# EAGLE schematic Aux Board V1 (EAGLE 9.2.0)
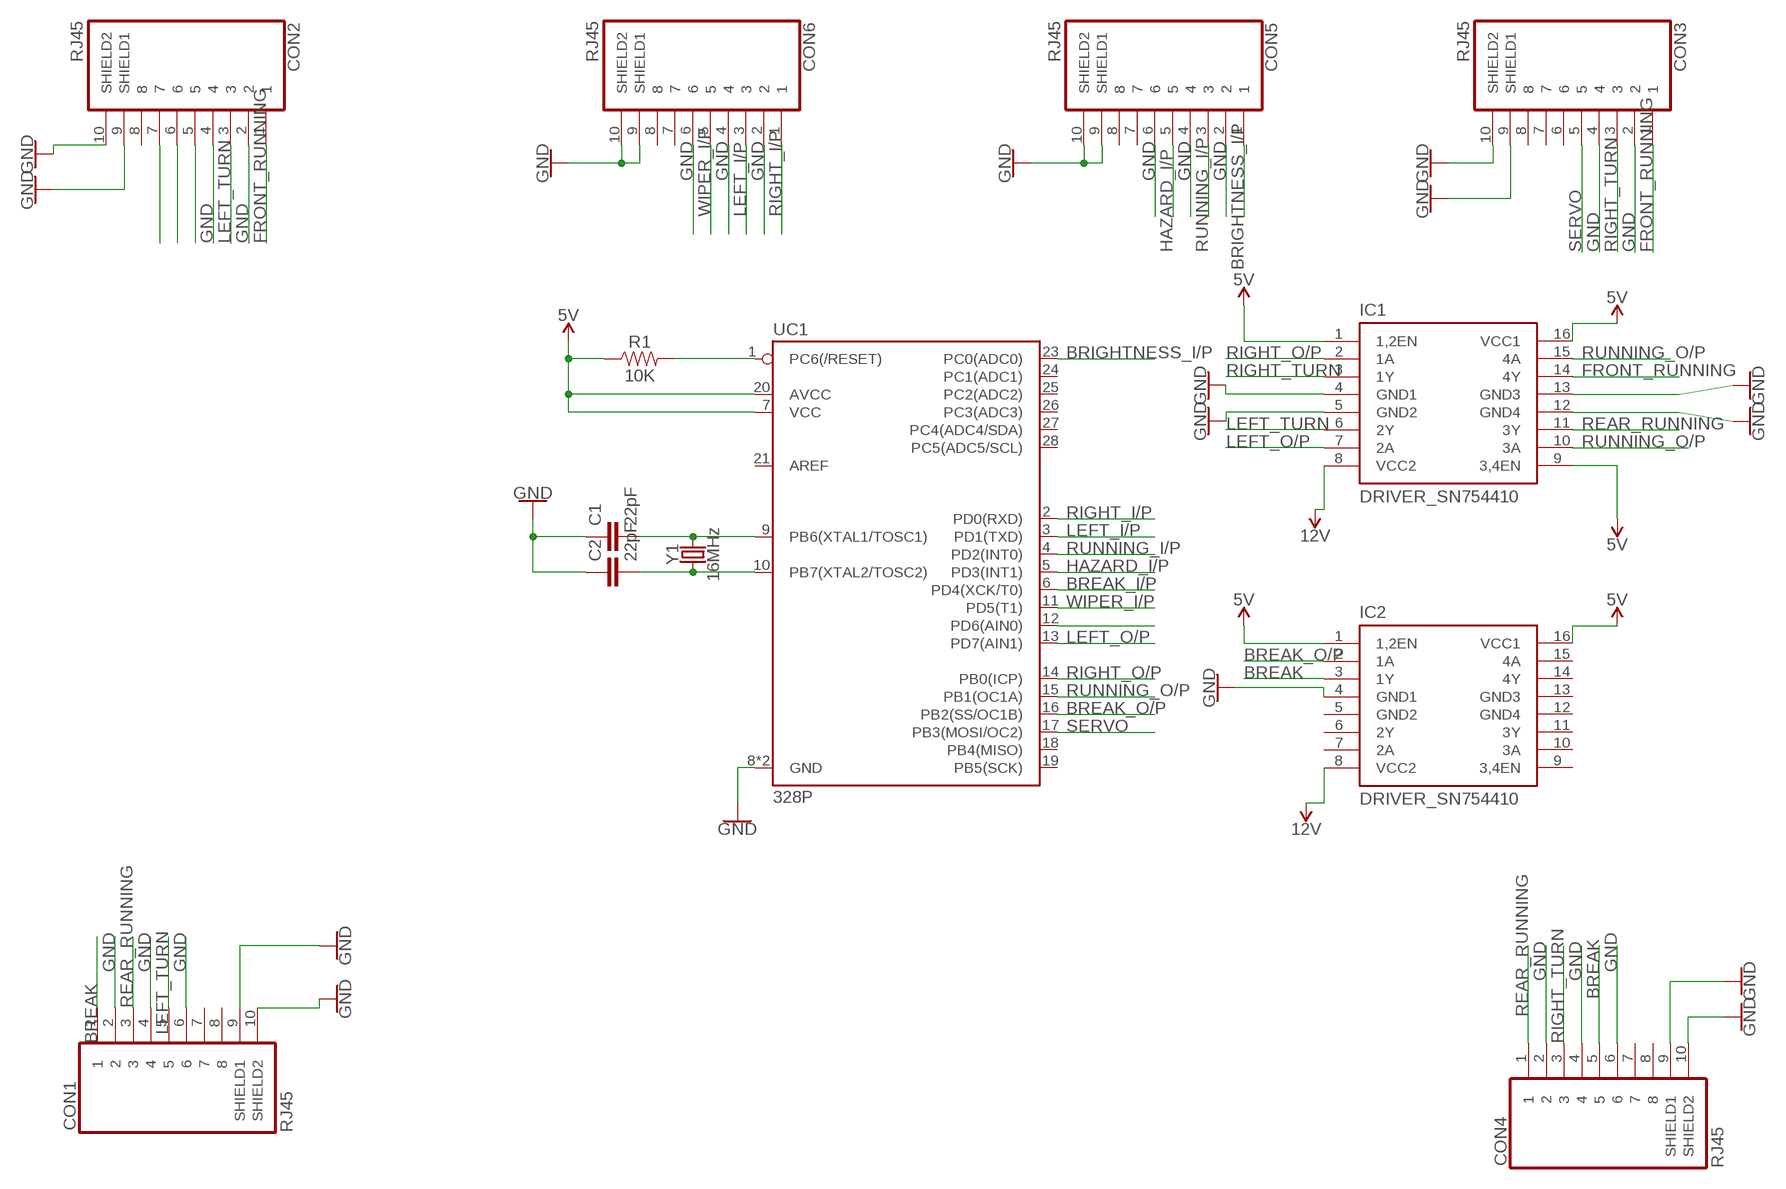
[diagram p0: schematic, sheet 1]

## Parts
C1  22pF  CAPACITOR_0805  [0805]
C2  22pF  CAPACITOR_0805  [0805]
CON1  RJ45  [RJ45]
CON2  RJ45  [RJ45]
CON3  RJ45  [RJ45]
CON4  RJ45  [RJ45]
CON5  RJ45  [RJ45]
CON6  RJ45  [RJ45]
IC1  DRIVER_SN754410  [DIP16]
IC2  DRIVER_SN754410  [DIP16]
R1  10K  RESISTOR_0805  [0805]
UC1  328P  ATMEGA328P_DIP28  [DIP28]
Y1  16MHz  CRYSTAL-16MHZPTH-HC49US  [HC49US]

## Nets
5V: IC1.1(1,2EN) IC1.9(3,4EN) IC1.16(VCC1) IC2.1(1,2EN) IC2.16(VCC1) R1.1 UC1.7(VCC) UC1.20(AVCC)
12V: IC1.8(VCC2) IC2.8(VCC2)
BREAK: CON1.1 CON4.5 IC2.3(1Y)
BREAK_I/P: UC1.6(PD4(XCK/T0))
BREAK_O/P: IC2.2(1A) UC1.16(PB2(SS/OC1B))
BRIGHTNESS_I/P: CON5.1 UC1.23(PC0(ADC0))
FRONT_RUNNING: CON2.1 CON3.1 IC1.14(4Y)
GND: C1.1 C2.1 CON1.2 CON1.4 CON1.6 CON1.9(SHIELD1) CON1.10(SHIELD2) CON2.2 CON2.4 CON2.9(SHIELD1) CON2.10(SHIELD2) CON3.2 CON3.4 CON3.9(SHIELD1) CON3.10(SHIELD2) CON4.2 CON4.4 CON4.6 CON4.9(SHIELD1) CON4.10(SHIELD2) CON5.2 CON5.4 CON5.6 CON5.9(SHIELD1) CON5.10(SHIELD2) CON6.2 CON6.4 CON6.6 CON6.9(SHIELD1) CON6.10(SHIELD2) IC1.4(GND1) IC1.5(GND2) IC1.12(GND4) IC1.13(GND3) IC2.4(GND1) UC1.8(GND) UC1.22(GND)
HAZARD_I/P: CON5.5 UC1.5(PD3(INT1))
LEFT_I/P: CON6.3 UC1.3(PD1(TXD))
LEFT_O/P: IC1.7(2A) UC1.13(PD7(AIN1))
LEFT_TURN: CON1.5 CON2.3 IC1.6(2Y)
N$1: UC1.12(PD6(AIN0))
N$2: R1.2 UC1.1(PC6(/RESET))
N$5: CON2.5
N$6: CON2.6
N$7: CON2.7
N$8: C1.2 UC1.9(PB6(XTAL1/TOSC1)) Y1.2
N$9: C2.2 UC1.10(PB7(XTAL2/TOSC2)) Y1.1
REAR_RUNNING: CON1.3 CON4.1 IC1.11(3Y)
RIGHT_I/P: CON6.1 UC1.2(PD0(RXD))
RIGHT_O/P: IC1.2(1A) UC1.14(PB0(ICP))
RIGHT_TURN: CON3.3 CON4.3 IC1.3(1Y)
RUNNING_I/P: CON5.3 UC1.4(PD2(INT0))
RUNNING_O/P: IC1.10(3A) IC1.15(4A) UC1.15(PB1(OC1A))
SERVO: CON3.5 UC1.17(PB3(MOSI/OC2))
WIPER_I/P: CON6.5 UC1.11(PD5(T1))
Unconnected: CON1.7 CON1.8 CON2.8 CON3.6 CON3.7 CON3.8 CON4.7 CON4.8 CON5.7 CON5.8 CON6.7 CON6.8 IC2.5(GND2) IC2.6(2Y) IC2.7(2A) IC2.9(3,4EN) IC2.10(3A) IC2.11(3Y) IC2.12(GND4) IC2.13(GND3) IC2.14(4Y) IC2.15(4A) UC1.18(PB4(MISO)) UC1.19(PB5(SCK)) UC1.21(AREF) UC1.24(PC1(ADC1)) UC1.25(PC2(ADC2)) UC1.26(PC3(ADC3)) UC1.27(PC4(ADC4/SDA)) UC1.28(PC5(ADC5/SCL))

## Library data of the parts
C1 C2 = EcoCar-Passives:CAPACITOR_0805
CON1-CON6 = EcoCar-Connectors:RJ45: RJ45 Connector - Use for signals and low power connections Unshielded Part Number: RJHSE-5080 Unshielded Digikey Part Number: RJHSE-5080-ND Shielded Part Number: RJHSE5E80 Shielded Digikey Part Number: RJHSE5E80-ND
IC1 IC2 = EcoCar-Integrated-Circuits:DRIVER_SN754410: SN754410 Quadruple Half-H Driver Manufacturer: Texas Instruments Part Number: SN754410NE Digikey Part Number: 296-9911-5-ND
R1 = EcoCar-Passives:RESISTOR_0805
UC1 = EcoCar-Microcontrollers:ATMEGA328P_DIP28: ATmega328P Manufacturer: Microchip Part Number: ATMEGA328P-PU Digikey Part Number: ATMEGA328P-PU-ND; PROD_ID: IC-09136
Y1 = EcoCar-Microcontrollers:CRYSTAL-16MHZ: 16MHz Crystal Oscillator Manufacturer: TXC Part Number: 9B-16.000MBBK-B Digikey Part Number: 887-2015-ND; PROD_ID: XTAL-08181; SF_ID: COM-00536